# EAGLE design motherboard (EAGLE 8.1.1)
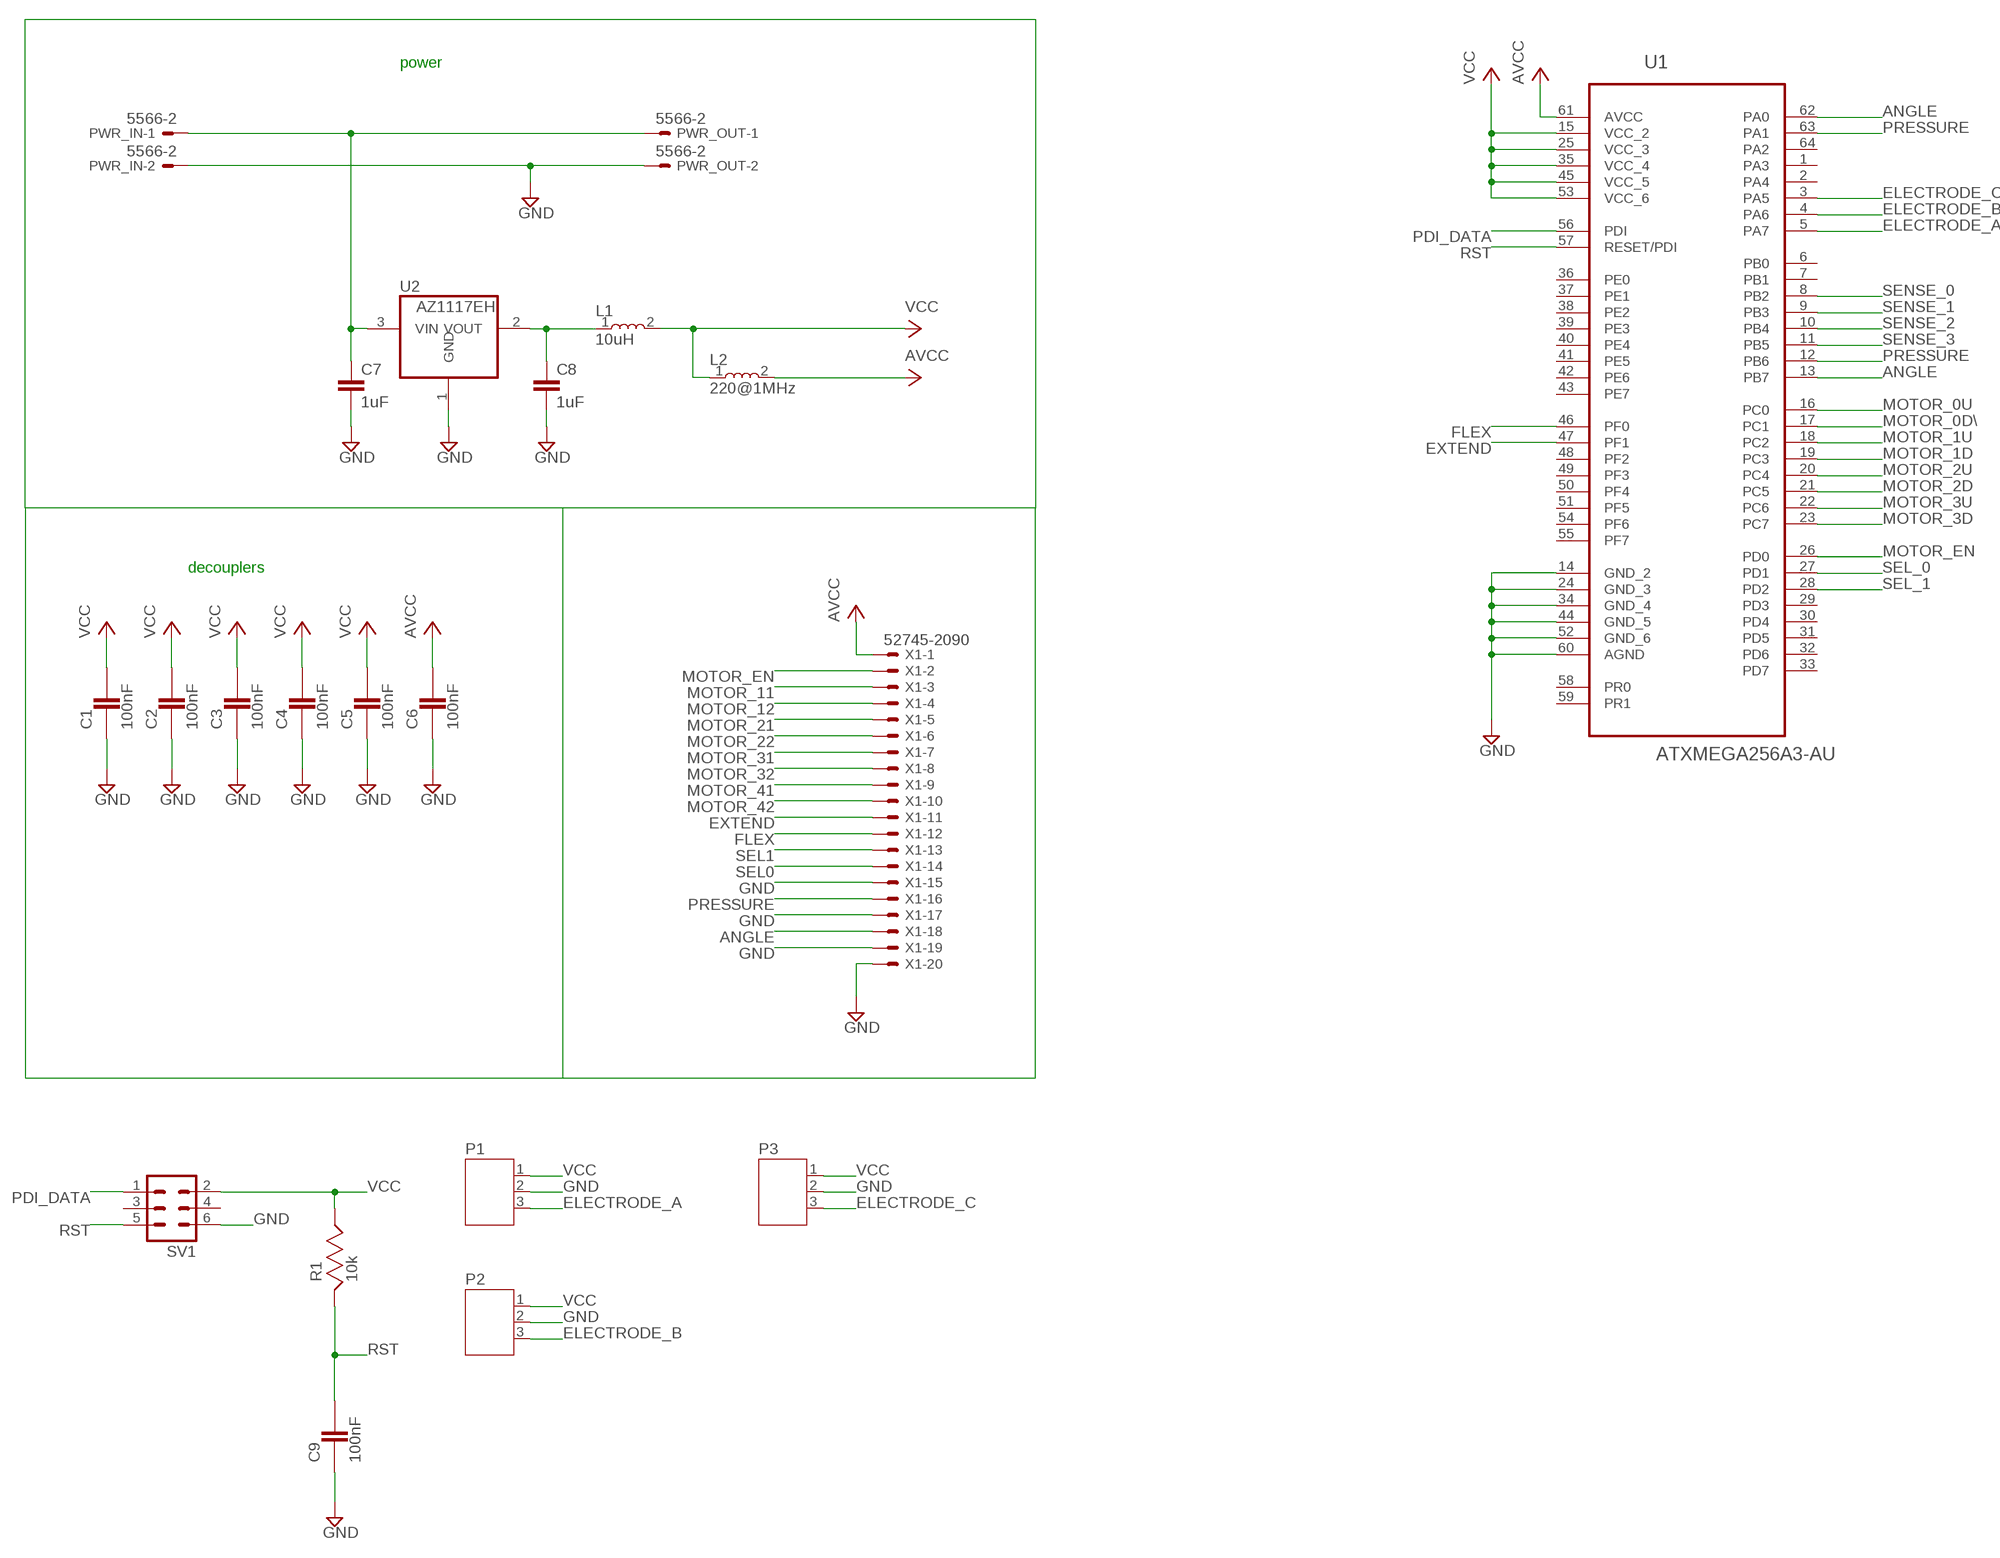
[diagram p0: schematic, sheet 1]

## Parts
C1  100nF  C0508  [0508]
C2  100nF  C0508  [0508]
C3  100nF  C0508  [0508]
C4  100nF  C0508  [0508]
C5  100nF  C0508  [0508]
C6  100nF  C0508  [0508]
C7  1uF  C-EUC0805  [C0805]
C8  1uF  C-EUC0805  [C0805]
C9  100nF  CC0603KRX7R8BB105  [CC0603KRX7R8BB105_CAPC1608X90]
L1  10uH  L0805  [0805]
L2  220@1MHz  L0805  [0805]
P1  JST-PH3  [JST-PH3]
P2  JST-PH3  [JST-PH3]
P3  JST-PH3  [JST-PH3]
PWR_IN  5566-2  [5566-2]
PWR_OUT  5566-2  [5566-2]
R1  10k  CRCW060310K0FKEA  [CRCW060310K0FKEA_RESC1608X55]
SV1  MA03-2  [MA03-2]
U1  ATXMEGA256A3-AU  [QFP80P1600X1600X120-64N]
U2  AZ1117EH  [SOT230P700X160-4N]
X1  52745-2090  [52745-2090]

## Nets
ANGLE: U1.13(PB7) U1.62(PA0) X1.18
AVCC: C6.P$1 L2.2 U1.61(AVCC) X1.1
BAT+: C7.1 PWR_IN.1 PWR_OUT.1 U2.3(VIN)
ELECTRODE_A: P1.3 U1.5(PA7)
ELECTRODE_B: P2.3 U1.4(PA6)
ELECTRODE_C: P3.3 U1.3(PA5)
EXTEND: U1.47(PF1) X1.11
FLEX: U1.46(PF0) X1.12
GND: C1.P$2 C2.P$2 C3.P$2 C4.P$2 C5.P$2 C6.P$2 C7.2 C8.2 C9.1 P1.2 P2.2 P3.2 PWR_IN.2 PWR_OUT.2 SV1.6 U1.14(GND_2) U1.24(GND_3) U1.34(GND_4) U1.44(GND_5) U1.52(GND_6) U1.60(AGND) U2.1(GND) X1.15 X1.17 X1.19 X1.20
MOTOR_0D\: U1.17(PC1)
MOTOR_0U: U1.16(PC0)
MOTOR_1D: U1.19(PC3)
MOTOR_1U: U1.18(PC2)
MOTOR_2D: U1.21(PC5)
MOTOR_2U: U1.20(PC4)
MOTOR_3D: U1.23(PC7)
MOTOR_3U: U1.22(PC6)
MOTOR_11: X1.3
MOTOR_12: X1.4
MOTOR_21: X1.5
MOTOR_22: X1.6
MOTOR_31: X1.7
MOTOR_32: X1.8
MOTOR_41: X1.9
MOTOR_42: X1.10
MOTOR_EN: U1.26(PD0) X1.2
N$1: C8.1 L1.1 U2.2(VOUT)
PDI_DATA: SV1.1 U1.56(PDI)
PRESSURE: U1.12(PB6) U1.63(PA1) X1.16
RST: C9.2 R1.1 SV1.5 U1.57(RESET/PDI)
SEL0: X1.14
SEL1: X1.13
SEL_0: U1.27(PD1)
SEL_1: U1.28(PD2)
SENSE_0: U1.8(PB2)
SENSE_1: U1.9(PB3)
SENSE_2: U1.10(PB4)
SENSE_3: U1.11(PB5)
VCC: C1.P$1 C2.P$1 C3.P$1 C4.P$1 C5.P$1 L1.2 L2.1 P1.1 P2.1 P3.1 R1.2 SV1.2 U1.15(VCC_2) U1.25(VCC_3) U1.35(VCC_4) U1.45(VCC_5) U1.53(VCC_6)
Unconnected: SV1.3 SV1.4 U1.1(PA3) U1.2(PA4) U1.6(PB0) U1.7(PB1) U1.29(PD3) U1.30(PD4) U1.31(PD5) U1.32(PD6) U1.33(PD7) U1.36(PE0) U1.37(PE1) U1.38(PE2) U1.39(PE3) U1.40(PE4) U1.41(PE5) U1.42(PE6) U1.43(PE7) U1.48(PF2) U1.49(PF3) U1.50(PF4) U1.51(PF5) U1.54(PF6) U1.55(PF7) U1.58(PR0) U1.59(PR1) U1.64(PA2)

## Notes on the sheet
- power
- decouplers

## Library data of the parts
C1-C6 = hands:C0508
C7 C8 = resistor:C-EU: CAPACITOR, European symbol
C9 = Common-Parts-Library-Eagle:CC0603KRX7R8BB105: Cap Ceramic 1uF 25V X7R 10% SMD 0603 125C Paper T/R; MANUFACTURER: YAGEO
L1 L2 = hands:L0805
P1-P3 = jst-ph:JST-PH3
PWR_IN PWR_OUT = con-molex:5566-2: Mini FIT connector 2 pol Source: http://www.molex.com; OC_FARNELL: 1822072; OC_NEWARK: unknown
R1 = Common-Parts-Library-Eagle:CRCW060310K0FKEA: Res Thick Film 0603 10K Ohm 1% 0.1W(1/10W) ?100ppm/C Molded SMD Automotive Paper T/R; MANUFACTURER: VISHAY
SV1 = con-lstb:MA03-2: PIN HEADER; OC_FARNELL: unknown; OC_NEWARK: unknown
U1 = ATXMEGA256A3-AU:ATXMEGA256A3-AU: MCU; AVAILABILITY: Good; DESCRIPTION: XMEGA Series 32 MHz 256 KB Flash 16 KB SRAM 8/16-Bit Microcontroller - TQFP-64; MF: Atmel; MP: ATXMEGA256A3-AU; PACKAGE: TQFP-64 Atmel; PRICE: 8.74 USD
U2 = hands:AZ1117EH
X1 = con-molex:52745-2090: FFC/FPC-to-Board 0.50mm (.020") SMT Top Contact Right Angle, ZIF, Style Receptacle 52745 / 52435 Source: http://www.molex.com/product/ffc/52745.html; MF: WALDOM/MOLEX; MPN: 52745-2090; OC_FARNELL: unknown; OC_NEWARK: 38C9891

## Board
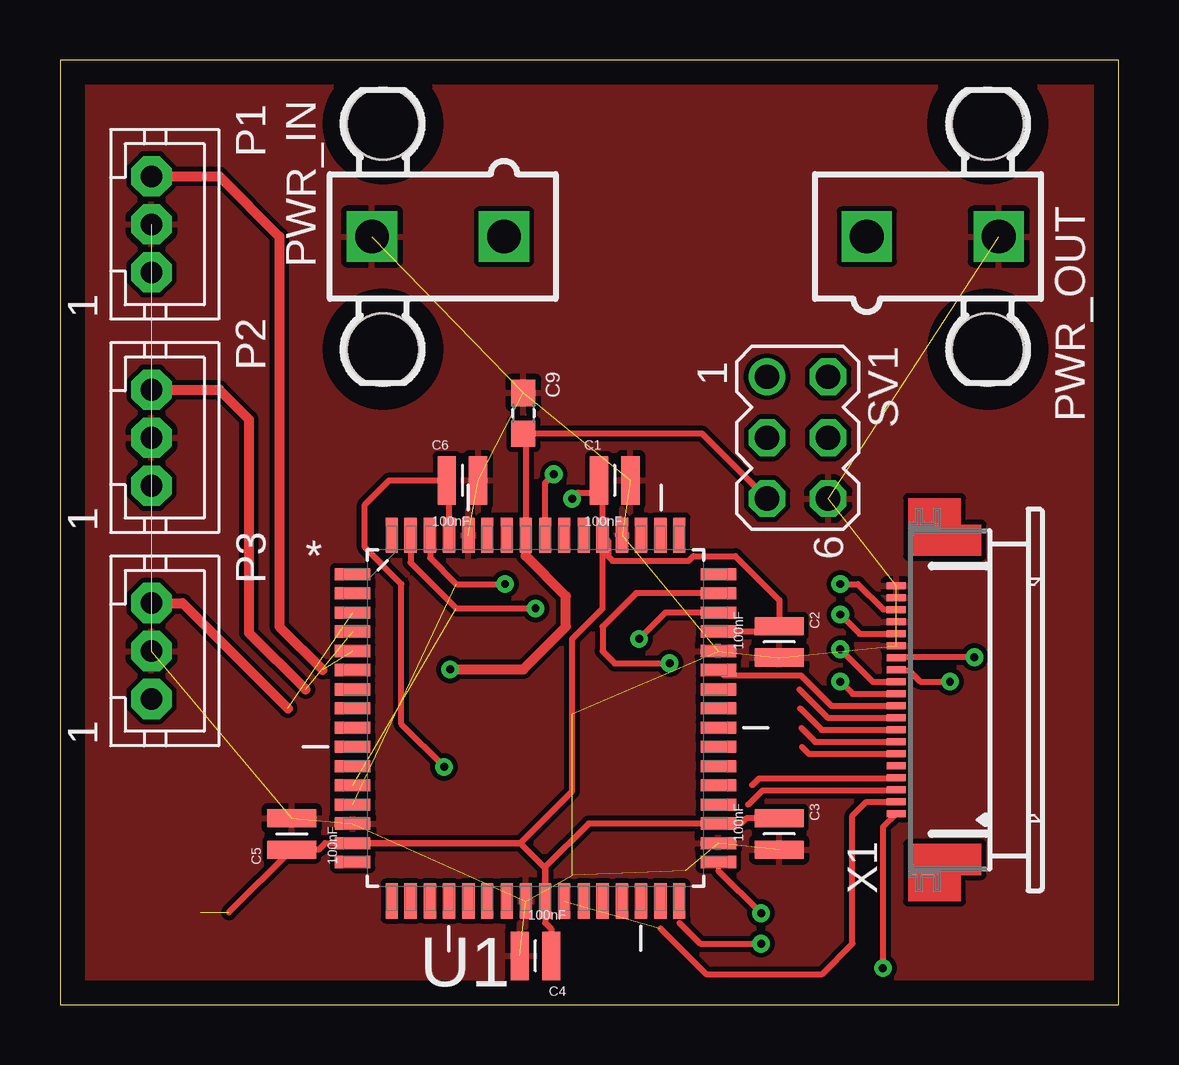
[diagram p1: board, top side]
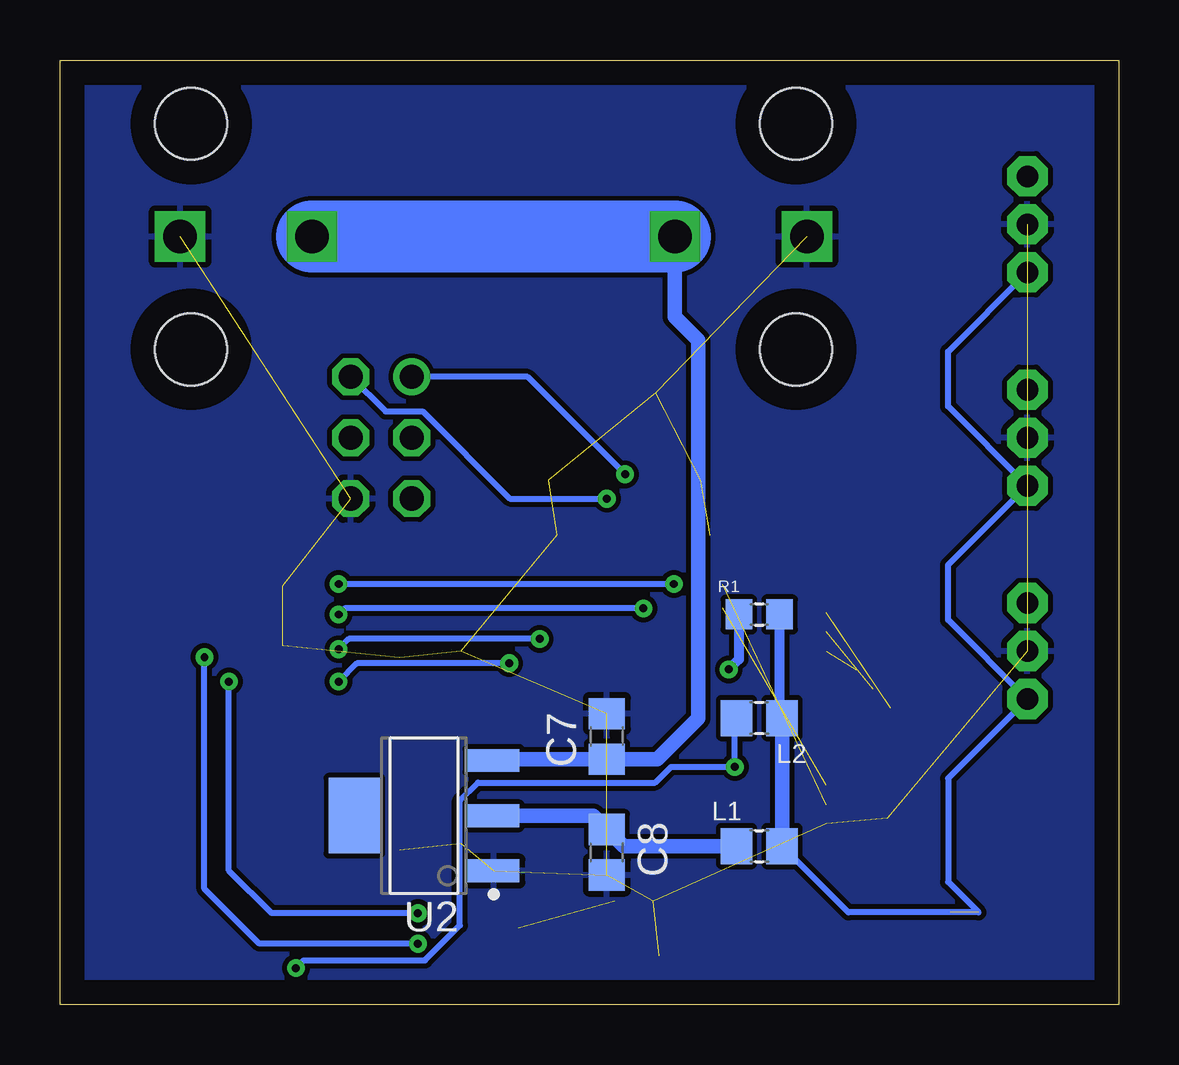
[diagram p2: board, bottom side, seen from below]

Size 44.12 x 39.36 mm. Coordinates in mm from the lower left corner, seen from the top.
Outline: 0,0 44.12,0 44.12,39.36 0,39.36 0,0
Copper layers (1*16): Top 0.035mm / dielectric 1.5mm / Bottom 0.035mm
Design rules "default": minimum track width 10mil, minimum drill 24mil, track to track 8mil, track to pad 8mil, pad to pad 8mil, via to via 8mil, smd to smd 8mil, copper to edge 40mil, drill to drill 8mil, minimum pad ring 10mil, minimum via ring 8mil, stop-mask expansion 4mil, vias tented up to drill 0mil, thermal gap 10mil

### Footprints (pad centres in the part's own frame; a part is rotated, then mirrored left to right if it is on the bottom)
0508 = smd 0.76 x 2.03: P$1 -0.653,0; P$2 0.653,0
C0805 = smd 1.3 x 1.5: 1 -0.95,0; 2 0.95,0
CC0603KRX7R8BB105_CAPC1608X90 = smd 1.1 x 1: 1 -0.85,0; 2 0.85,0
0805 = smd 1.3 x 1.5: 1 -0.95,0; 2 0.95,0
JST-PH3 = drill 0.9 pad 1.676 octagon: 1 2,0; 2 0,0; 3 -2,0
5566-2 = drill 1.4 square: 1 0,-2.75; 2 0,2.75 | hole 3: 4.7,2.29; -4.7,2.29
CRCW060310K0FKEA_RESC1608X55 = smd 1.1 x 1.25: 1 -0.85,0; 2 0.85,0
MA03-2 = drill 1.016: 1 -2.54,-1.27 | drill 1.016 octagon: 2 -2.54,1.27; 3 0,-1.27; 4 0,1.27; 5 2.54,-1.27; 6 2.54,1.27
QFP80P1600X1600X120-64N = smd 1.473 x 0.508: 1 -7.62,5.994; 2 -7.62,5.207; 3 -7.62,4.394; 4 -7.62,3.607; 5 -7.62,2.794; 6 -7.62,2.007; 7 -7.62,1.194; 8 -7.62,0.406; 9 -7.62,-0.406; 10 -7.62,-1.194; 11 -7.62,-2.007; 12 -7.62,-2.794; 13 -7.62,-3.607; 14 -7.62,-4.394; 15 -7.62,-5.207; 16 -7.62,-5.994; 33 7.62,-5.994; 34 7.62,-5.207; 35 7.62,-4.394; 36 7.62,-3.607; 37 7.62,-2.794; 38 7.62,-2.007; 39 7.62,-1.194; 40 7.62,-0.406; 41 7.62,0.406; 42 7.62,1.194; 43 7.62,2.007; 44 7.62,2.794; 45 7.62,3.607; 46 7.62,4.394; 47 7.62,5.207; 48 7.62,5.994 | smd 0.508 x 1.473: 17 -5.994,-7.62; 18 -5.207,-7.62; 19 -4.394,-7.62; 20 -3.607,-7.62; 21 -2.794,-7.62; 22 -2.007,-7.62; 23 -1.194,-7.62; 24 -0.406,-7.62; 25 0.406,-7.62; 26 1.194,-7.62; 27 2.007,-7.62; 28 2.794,-7.62; 29 3.607,-7.62; 30 4.394,-7.62; 31 5.207,-7.62; 32 5.994,-7.62; 49 5.994,7.62; 50 5.207,7.62; 51 4.394,7.62; 52 3.607,7.62; 53 2.794,7.62; 54 2.007,7.62; 55 1.194,7.62; 56 0.406,7.62; 57 -0.406,7.62; 58 -1.194,7.62; 59 -2.007,7.62; 60 -2.794,7.62; 61 -3.607,7.62; 62 -4.394,7.62; 63 -5.207,7.62; 64 -5.994,7.62
SOT230P700X160-4N = smd 2.15 x 0.95: 1 -2.9,2.3; 2 -2.9,0; 3 -2.9,-2.3 | smd 2.15 x 3.15: 4 2.9,0
52745-2090 = smd 0.3 x 0.8: 1 -4.75,2.5; 2 -4.25,2.5; 3 -3.75,2.5; 4 -3.25,2.5; 5 -2.75,2.5; 6 -2.25,2.5; 7 -1.75,2.5; 8 -1.25,2.5; 9 -0.75,2.5; 10 -0.25,2.5; 11 0.25,2.5; 12 0.75,2.5; 13 1.25,2.5; 14 1.75,2.5; 15 2.25,2.5; 16 2.75,2.5; 17 3.25,2.5; 18 3.75,2.5; 19 4.25,2.5; 20 4.75,2.5

### Placement (x,y rotation side)
C1  23.11,21.84 0 top
C2  29.97,15.11 270 top
C3  29.97,7.11 270 top
C4  19.81,2.03 180 top
C5  9.65,7.11 90 top
C6  16.76,21.84 0 top
C7  21.34,11.18 90 bottom
C8  21.34,6.35 270 bottom
C9  19.3,24.64 270 top
L1  14.99,6.6 0 bottom
L2  14.99,11.94 180 bottom
P1  3.81,32.51 270 top
P2  3.81,23.62 270 top
P3  3.81,14.73 270 top
PWR_IN  15.75,32 90 top
PWR_OUT  36.37,32 270 top
R1  14.99,16.26 0 bottom
SV1  30.73,23.62 270 top
U1  19.81,11.94 0 top
U2  28.96,7.87 180 bottom
X1  37.34,12.7 90 top

### Tracks (layer width: path | path; a pad name or v marks a point on that pad's centre or on a via)
ANGLE  (via drill 0.33)  (1 unrouted)
  Top 0.254: U1.62 15.42,18.62 16.51,17.53 v18.54,17.53 | X1.18 34.82,16.47 34.3,16.47 33.24,17.53 v32.51,17.53
  Bottom 0.254: v18.54,17.53 v32.51,17.53
AVCC  (via drill 0.33 pad 0.74)
  Top 0.254: v16,9.91 14.22,11.68 14.22,17.53 12.7,19.05 12.7,20.83 13.72,21.84 C6.P$1 16.2,21.75 U1.61 | X1.1 34.29,7.4 v34.29,1.52
  Bottom 0.254: L2.2 16,11.87 v16,9.91 18.66,9.91 19.32,9.25 26.7,9.25 27.46,8.49 27.46,3.3 28.92,1.84 33.97,1.84 v34.29,1.52
BAT+
  Bottom 0.61: U2.3 26,10.23 C7.1 19.24,10.23 17.53,11.94 17.53,27.69 18.5,28.66 PWR_IN.1
  Bottom 2.997: PWR_IN.1 PWR_OUT.1
ELECTRODE_A  (1 unrouted)
  Top 0.406: P1.3 6.64,34.51 9.14,32 9.14,15.75 10.95,13.95
ELECTRODE_B  (1 unrouted)
  Top 0.406: P2.3 6.64,25.62 7.87,24.38 7.87,15.49 10.24,13.13
ELECTRODE_C  (1 unrouted)
  Top 0.406: P3.3 5.11,16.73 9.5,12.34
EXTEND  (via drill 0.33)
  Top 0.254: U1.47 24,17.14 22.61,15.75 22.61,14.73 23.11,14.22 v25.4,14.22 | v32.51,13.46 33.02,12.95 X1.11
  Bottom 0.254: v25.4,14.22 31.75,14.22 v32.51,13.46
FLEX  (via drill 0.33)
  Top 0.254: U1.46 25.22,16.33 v24.13,15.24 | v32.51,14.81 33.87,13.45 X1.12
  Bottom 0.254: v32.51,14.81 32.08,15.24 v24.13,15.24
GND  (25 unrouted)
  pour Top: -2.29,40.39 46.48,40.39 46.48,-2.29 -2.54,-2.29 -2.54,40.39
  pour Bottom: -1.02,39.88 45.72,39.88 45.72,-1.52 -1.02,-1.52
MOTOR_11
  Top 0.254: X1.3 34.82,8.93 29.27,8.93 28.68,8.33
MOTOR_12
  Top 0.254: X1.4 34.82,9.43 29.13,9.43 28.84,9.14
MOTOR_21
  Top 0.254: 34.84,9.93 X1.5
MOTOR_22
  Top 0.254: X1.6 31.21,10.45 30.91,10.74
MOTOR_31
  Top 0.254: X1.7 31.47,10.95 30.89,11.53
MOTOR_32
  Top 0.254: X1.8 31.73,11.45 30.84,12.34
MOTOR_41
  Top 0.254: 30.81,13.13 32,11.94 32.02,11.95 X1.9
MOTOR_42
  Top 0.254: X1.10 32.14,12.45 30.87,13.72 27.66,13.72
MOTOR_EN  (1 unrouted)
  Top 0.254: 25.02,3.17 26.92,1.27 31.75,1.27 33.02,2.54 33.02,7.87 33.6,8.45 X1.2
N$1
  Bottom 0.61: U2.2 21.91,7.87 C8.1 20.64,6.6 L1.1
PDI_DATA  (via drill 0.33 pad 0.74)
  Top 0.254: U1.56 20.22,21.74 v20.57,22.1
  Bottom 0.254: v20.57,22.1 24.64,26.16 SV1.1
PRESSURE  (via drill 0.33)  (1 unrouted)
  Top 0.254: U1.63 14.61,18.41 16.51,16.51 v19.81,16.51 | v32.51,16.26 33.32,15.45 X1.16
  Bottom 0.254: v19.81,16.51 32.26,16.51 v32.51,16.26
RST  (via drill 0.33)
  Top 0.254: SV1.5 26.76,23.79 C9.2 19.41,23.79 U1.57
  Top 0.406: v16.26,13.97 19.3,13.97 21.08,15.75 21.08,17.02 19.41,18.69 U1.57
  Bottom 0.406: R1.1 15.84,14.39 v16.26,13.97
SEL0  (via drill 0.33)
  Top 0.254: 25.81,3.4 26.67,2.54 v29.21,2.54 | v38.1,14.48 35.38,14.48 35.38,14.47 34.86,14.47 X1.14
  Bottom 0.254: v29.21,2.54 35.81,2.54 38.1,4.83 v38.1,14.48
SEL1  (via drill 0.33)
  Top 0.254: 27.43,5.59 v29.21,3.81 | X1.13 34.86,13.93 35.38,13.93 35.84,13.46 v37.08,13.46
  Bottom 0.254: v29.21,3.81 35.31,3.81 37.08,5.59 v37.08,13.46
VCC  (via drill 0.33 pad 0.74)  (1 unrouted)
  Top 0.254: 7.04,3.84 C5.P$1 10.78,6.46 11.05,6.73 U1.15 | C3.P$1 28.59,7.76 28.37,7.54 U1.35 22.02,7.54 20.22,5.74 U1.25 | U1.25 20.22,3.4 20.46,3.16 C4.P$1 | U1.25 20.22,5.69 19.18,6.73 | 19.18,6.73 U1.15 | C1.P$1 22.61,21.84 22.61,21.34 | U1.53 22.61,21.34 | U1.53 22.84,19.33 22.84,18.68 23.03,18.49 26.2,18.49 26.39,18.68 28.14,18.68 29.97,16.85 C2.P$1 29.75,15.54 U1.45 | v21.34,21.08 21.59,21.34 22.61,21.34 | U1.15 19.18,6.73 | 19.18,6.73 21.34,8.89 21.34,15.24 22.61,16.51 U1.53
  Bottom 0.254: L1.2 11.27,3.84 5.84,3.84 7.11,5.11 7.11,9.43 P3.1 7.11,16.03 7.11,18.32 P2.1 7.11,24.92 7.11,27.21 P1.1 | SV1.2 30.56,24.71 29.01,24.71 25.38,21.08 v21.34,21.08
  Bottom 0.406: 14.14,12.04 R1.2
  Bottom 0.61: L1.2 L2.1 14.14,12.04